# Altium schematic sheet 00 - Structure.SchDoc
size A4
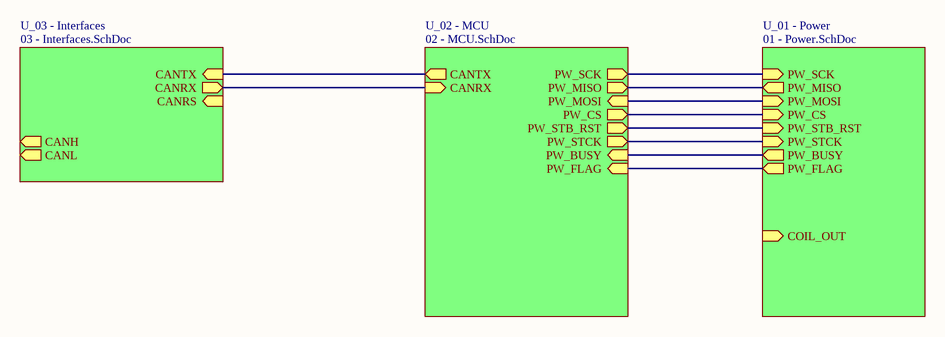
[diagram p0: 00 - Structure.SchDoc]

## Sub-sheets
U_01 - Power = 01 - Power.SchDoc: COIL_OUT (in), PW_CS (in), PW_SCK (in), PW_MISO (out), PW_MOSI (in), PW_STB_RST (in), PW_BUSY (out), PW_FLAG (out), PW_STCK (in)
U_02 - MCU = 02 - MCU.SchDoc: CANTX (out), CANRX (in), PW_SCK (out), PW_MISO (out), PW_MOSI (in), PW_CS (out), PW_STB_RST (out), PW_STCK (out), PW_BUSY (in), PW_FLAG (in)
U_03 - Interfaces = 03 - Interfaces.SchDoc: CANH (out), CANL (out), CANTX (in), CANRX (out), CANRS (in)

## Nets
(unnamed): sheet U_01 - Power/PW_CS, sheet U_02 - MCU/PW_CS
(unnamed): sheet U_01 - Power/PW_SCK, sheet U_02 - MCU/PW_SCK
(unnamed): sheet U_01 - Power/PW_MISO, sheet U_02 - MCU/PW_MISO
(unnamed): sheet U_01 - Power/PW_MOSI, sheet U_02 - MCU/PW_MOSI
(unnamed): sheet U_01 - Power/PW_STB_RST, sheet U_02 - MCU/PW_STB_RST
(unnamed): sheet U_01 - Power/PW_BUSY, sheet U_02 - MCU/PW_BUSY
(unnamed): sheet U_01 - Power/PW_FLAG, sheet U_02 - MCU/PW_FLAG
(unnamed): sheet U_01 - Power/PW_STCK, sheet U_02 - MCU/PW_STCK
(unnamed): sheet U_02 - MCU/CANTX, sheet U_03 - Interfaces/CANTX
(unnamed): sheet U_02 - MCU/CANRX, sheet U_03 - Interfaces/CANRX